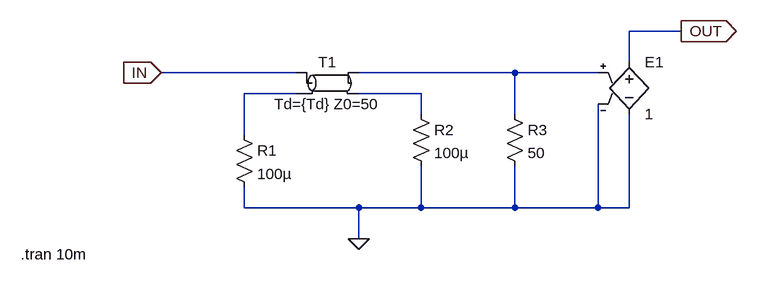
[diagram p0: schematic signal_delay_block.asc]
signal_delay_block.asc, the LTspice schematic file:
Version 4
SHEET 1 880 680
WIRE 656 32 576 32
WIRE 576 80 576 32
WIRE 64 96 -144 96
WIRE 400 96 160 96
WIRE 528 96 400 96
WIRE 64 128 -16 128
WIRE 256 128 160 128
WIRE 256 160 256 128
WIRE 400 160 400 96
WIRE -16 192 -16 128
WIRE -16 304 -16 272
WIRE 160 304 -16 304
WIRE 256 304 256 240
WIRE 256 304 160 304
WIRE 400 304 400 240
WIRE 400 304 256 304
WIRE 528 304 528 144
WIRE 528 304 400 304
WIRE 576 304 576 160
WIRE 576 304 528 304
WIRE 160 352 160 304
FLAG 160 352 0
FLAG -144 96 IN
IOPIN -144 96 In
FLAG 656 32 OUT
IOPIN 656 32 Out
SYMBOL tline 112 112 R0
SYMATTR InstName T1
SYMATTR Value Td={Td} Z0=50
SYMBOL res -32 176 R0
SYMATTR InstName R1
SYMATTR Value 100µ
SYMBOL res 240 144 R0
SYMATTR InstName R2
SYMATTR Value 100µ
SYMBOL res 384 144 R0
SYMATTR InstName R3
SYMATTR Value 50
SYMBOL e 576 64 R0
SYMATTR InstName E1
SYMATTR Value 1
TEXT -360 376 Left 2 !.tran 10m

The netlist it stands for:
* signal_delay_block.asc
T1 IN N002 N001 N003 Td={Td} Z0=50
R1 N002 0 100µ
R2 N003 0 100µ
R3 N001 0 50
E1 OUT 0 N001 0 1
.tran 10m
.backanno
.end